# EAGLE schematic GenericFabBoardFTDI (EAGLE 5.03)
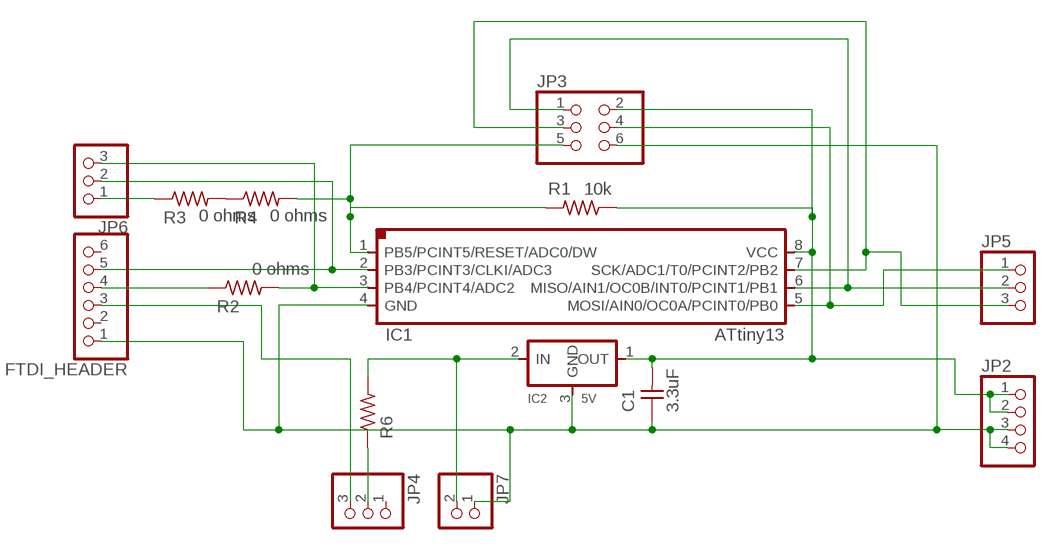
[diagram p0: schematic, sheet 1]

## Parts
C1  3.3uF  UNPOLARIZED_CAPACITOR1206  [1206]
FTDI_HEADER  PINHD-1X6  [1X06]
IC1  ATTINY13SI  [SOIC8]
IC2  5V  REGULATORSOT23  [SOT23]
JP2  PINHD-1X4  [1X04]
JP3  PINHD-2X3  [2X03]
JP4  PINHD-1X3  [1X03]
JP5  PINHD-1X3  [1X03]
JP6  PINHD-1X3  [1X03]
JP7  PINHD-1X2  [1X02]
R1  10k  RESISTOR1206  [1206]
R2  0 ohms  RESISTOR1206  [1206]
R3  0 ohms  RESISTOR1206  [1206]
R4  0 ohms  RESISTOR1206  [1206]
R6  0 ohms  RESISTOR1206  [1206]

## Nets
GND: C1.1 FTDI_HEADER.1 IC1.4(GND) IC2.3(GND) JP2.3 JP2.4 JP3.6 JP7.1
N$1: C1.2 IC1.8(VCC) IC2.1(OUT) JP2.1 JP2.2 JP3.2 R1.1
N$2: FTDI_HEADER.5 IC1.2(PB3/PCINT3/CLKI/ADC3) JP6.2
N$3: IC1.6(MISO/AIN1/OC0B/INT0/PCINT1/PB1) JP3.1 JP5.2
N$4: IC1.1(PB5/PCINT5/RESET/ADC0/DW) JP3.5 R1.2 R4.2
N$6: JP4.2 R6.1
N$8: R3.2 R4.1
N$11: IC1.7(SCK/ADC1/T0/PCINT2/PB2) JP3.3 JP5.3
N$12: IC1.5(MOSI/AIN0/OC0A/PCINT0/PB0) JP3.4 JP5.1
N$15: IC1.3(PB4/PCINT4/ADC2) JP6.3 R2.2
N$16: FTDI_HEADER.3 JP4.3
N$17: FTDI_HEADER.4 R2.1
N$18: IC2.2(IN) JP7.2 R6.2
N$19: JP6.1 R3.1
Unconnected: FTDI_HEADER.2 FTDI_HEADER.6 JP4.1

## Library data of the parts
C1 = ng:UNPOLARIZED_CAPACITOR: unpolarized_capacitor
FTDI_HEADER = pinhead:PINHD-1X6: PIN HEADER
IC1 = ng:ATTINY13
IC2 = ng:REGULATOR
JP2 = pinhead:PINHD-1X4: PIN HEADER
JP3 = pinhead:PINHD-2X3: PIN HEADER
JP4-JP6 = pinhead:PINHD-1X3: PIN HEADER
JP7 = pinhead:PINHD-1X2: PIN HEADER
R1-R4 R6 = ng:RESISTOR